# Altium schematic sheet Schematic_Lazy-bot_v0.1.4.schdoc
size 395 x 91 mm
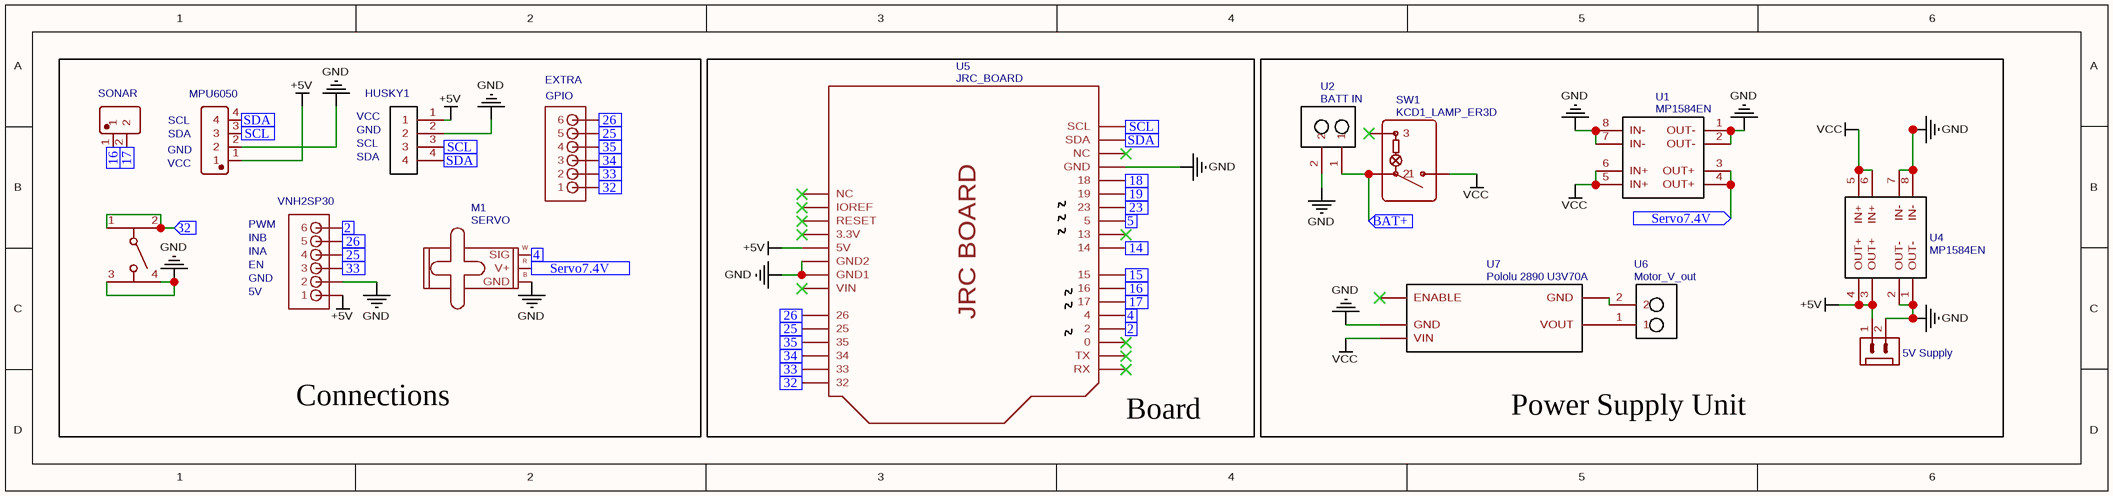
[diagram p0: Schematic_Lazy-bot_v0.1.4.schdoc]

## Parts
1V_5  5V Supply  [JST-2.54-2PIN-CONNECTOR]
EXTRA  JST-XH-6-PIN-HEADER-2.5  [JST-XH-6PIN-2.5]  (value not drawn)
HUSKY1  HUSKY  [4PIN]  (value not drawn)
M1  SERVO  [1X03]
MPU6050  VL53L0X  [CONN-TH_4P-P2.50_4PIN]  (value not drawn)
SONAR  CONZC2_0-2  [CONN-TH_2P-P2.50-XH2.54-2P]  (value not drawn)
SW1  KCD1_LAMP_ER3D  [KCD1-203]
SW2  12mm x 12mm tactile push button  [BIG TACTILE PUSH BUTTON]  (value not drawn)
U1  MP1584EN  [MP1484EN DC-DC BUCK CONVERTER (7.5X8.5)]
U2  BATT IN  [2 PIN TERMINAL]
U4  MP1584EN  [MP1484EN DC-DC BUCK CONVERTER (7.5X8.5)]
U5  JRC_BOARD  [ARDUINO UNO INVERTED]
U6  Motor_V_out  [2 PIN TERMINAL]
U7  Pololu 2890 U3V70A  [POLOLU 2890 4.5-20V FINE-ADJUST STEP-UP VOLTAGE REGULATOR U3V70A]
VNH2SP30  JST-XH-6-PIN-HEADER-2.5  [JST-XH-6PIN-2.5]  (value not drawn)

## Blocks framed on the sheet
Connections: EXTRA HUSKY1 M1 MPU6050 SONAR SW2 VNH2SP30
Board: U5
Power Supply Unit: 1V_5 SW1 U1 U2 U4 U6 U7

## Ports
2 (in), 4 (in), 5 (in), 14 (in), 15 (in), 16 (in), 17 (in), 18 (in), 19 (in), 23 (in), 25 (in), 26 (in), 32 (in), 33 (in), 34 (in), 35 (in), BAT+ (in), SCL (in), SDA (in), Servo7.4V (in)

## Nets
+5V: 1V_5.1(5V) HUSKY1.1 MPU6050.1 U4.3(OUT+) U4.4(OUT+) U5.5V VNH2SP30.1
GND: 1V_5.2(GND) HUSKY1.2 M1.3(GND) MPU6050.2 SW2.3 SW2.4 U1.1(OUT-) U1.2(OUT-) U1.7(IN-) U1.8(IN-) U2.2 U4.1(OUT-) U4.2(OUT-) U4.7(IN-) U4.8(IN-) U5.GND U5.GND1 U5.GND2 U7.GND VNH2SP30.2
VCC: SW1.1 U1.5(IN+) U1.6(IN+) U4.5(IN+) U4.6(IN+) U7.VIN
2: U5.D3(2) VNH2SP30.6 ; port 2
4: M1.1(SIG) U5.D4(4) ; port 4
5: U5.D10(5) ; port 5
14: U5.D8(14) ; port 14
15: U5.D7(15) ; port 15
16: SONAR.1 U5.D6(16) ; port 16
17: SONAR.2 U5.D5(17) ; port 17
18: U5.D13(18) ; port 18
19: U5.D12(19) ; port 19
23: U5.D11(23) ; port 23
25: EXTRA.5 U5.A1(25) VNH2SP30.4 ; port 25
26: EXTRA.6 U5.A0(26) VNH2SP30.5 ; port 26
32: EXTRA.1 SW2.1 SW2.2 U5.A5(32) ; port 32
33: EXTRA.2 U5.A4(33) VNH2SP30.3 ; port 33
34: EXTRA.3 U5.A3(34) ; port 34
35: EXTRA.4 U5.A2(35) ; port 35
BAT+: SW1.2 U2.1 ; port BAT+
SCL: HUSKY1.3 MPU6050.3 U5.SCL ; port SCL
SDA: HUSKY1.4 MPU6050.4 U5.SDA ; port SDA
Servo7.4V: M1.2(V+) U1.3(OUT+) U1.4(OUT+) ; port Servo7.4V
NetU6_1: U6.1 U7.VOUT
NetU6_2: U6.2 U7.GND

Not connected (* = marked no-connect by the designer): SW1 3*; U5 3V(3.3V)* AREF(NC)* D0(RX)* D1(TX)* D2(0)* D9(13)* IOREF* NC* RESET* VIN*; U7 ENABLE*

## Notes on the sheet
- (near EXTRA) GPIO
- GND
- VCC
- SCL
- SDA
- (near HUSKY1) VCC
- (near HUSKY1) GND
- (near HUSKY1) SCL
- (near HUSKY1) SDA
- PWM
- INB
- (near VNH2SP30) INA
- EN
- 5V
- (near VNH2SP30) GND
- (in symbol JRC_BOARD) JRC BOARD
- (in symbol SERVO) W; R; B

## Library data of the parts
1V_5 = 5V Supply: Contributor: Павел Колесов; spicePre: J; spiceSymbolName: 2PIN-HEADER-2.54
EXTRA VNH2SP30 = JST-XH-6-PIN-HEADER-2.5: Contributor: hs3uka; spicePre: J; spiceSymbolName: JST-XH-6-PIN-HEADER-2.5
HUSKY1 = HUSKY: Contributor: starrytime; spicePre: U; spiceSymbolName: 4PIN
M1 = SERVO: description: Small servo motor; Contributor: SparkFun; spicePre: M; spiceSymbolName: SMALL_SERVO
MPU6050 = VL53L0X: BOM_Manufacturer Part: 4PIN白色直针插座; BOM_Manufacturer: null; Contributor: LCSC; BOM_Supplier: LCSC; BOM_Supplier Part: C9900004960; BOM_JLCPCB Part Class: Extended Part; spicePre: C; spiceSymbolName: 4PIN白色直针插座
SONAR = CONZC2_0-2: BOM_Manufacturer: null; Contributor: LCSC; BOM_Supplier: LCSC; BOM_Supplier Part: C9900010743; BOM_Manufacturer Part: CONZC2_0-2; BOM_JLCPCB Part Class: Extended Part; spicePre: C; spiceSymbolName: CONZC2_0-2
SW1 = KCD1_LAMP_ER3D: BOM_Manufacturer: ROCKTEK; BOM_Manufacturer Part: RT-S02-113-R42BR; Contributor: iylee; BOM_Supplier: LCSC; BOM_Supplier Part: C309263; spicePre: S; spiceSymbolName: KCD1_LAMP_ER3D
SW2 = 12mm x 12mm tactile push button: Contributor: adeelmoizzafar802; spicePre: S; spiceSymbolName: 12mm x 12mm tactile push button
U1 U4 = MP1584EN: Contributor: dotsha747; BOM_Supplier Part: https://goo.gl/G1LPMP; spicePre: U; spiceSymbolName: MP1484EN DC-DC Buck 4.2-23V Input Step-Down Regulator Converter Adjustable Output
U2 = BATT IN: Contributor: Dimitrij Akimov; BOM_Supplier: Wemos; spicePre: U; spiceSymbolName: 2 pin terminal
U5 = JRC_BOARD: description: Arduino DiecimilaDuemilanove; Contributor: Adafruit; spicePre: U; spiceSymbolName: ARDUINO UNO INVERTED
U6 = Motor_V_out: Contributor: Dimitrij Akimov; BOM_Supplier: Wemos; spicePre: U; spiceSymbolName: 2 pin terminal
U7 = Pololu 2890 U3V70A: BOM_Manufacturer Part: 2890; Contributor: XYZ-TC; BOM_Supplier Part: 2570; link: https://www.pololu.com/product/2890; spicePre: U; spiceSymbolName: Pololu 2890 U3V70A